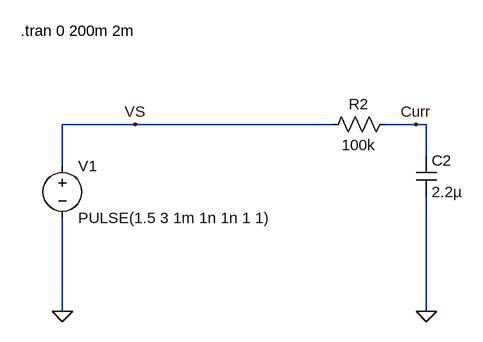
[diagram p0: schematic Current-Filter.asc]
Current-Filter.asc, the LTspice schematic file:
Version 4
SHEET 1 2012 996
WIRE -112 160 -224 160
WIRE 192 160 -112 160
WIRE 320 160 272 160
WIRE 336 160 320 160
WIRE 336 208 336 160
WIRE -224 224 -224 160
WIRE -224 448 -224 304
WIRE 336 448 336 272
FLAG -224 448 0
FLAG -112 160 VS
FLAG 336 448 0
FLAG 320 160 Curr
SYMBOL voltage -224 208 R0
WINDOW 123 0 0 Left 0
WINDOW 39 24 124 Left 2
SYMATTR InstName V1
SYMATTR Value PULSE(1.5 3 1m 1n 1n 1 1)
SYMBOL res 288 144 R90
WINDOW 0 0 56 VBottom 2
WINDOW 3 32 56 VTop 2
SYMATTR InstName R2
SYMATTR Value 100k
SYMBOL cap 320 208 R0
SYMATTR InstName C2
SYMATTR Value 2.2µ
TEXT -288 16 Left 2 !.tran 0 200m 2m

The netlist it stands for:
* Current-Filter.asc
V1 VS 0 PULSE(1.5 3 1m 1n 1n 1 1)
R2 Curr VS 100k
C2 Curr 0 2.2µ
.tran 0 200m 2m
.backanno
.end